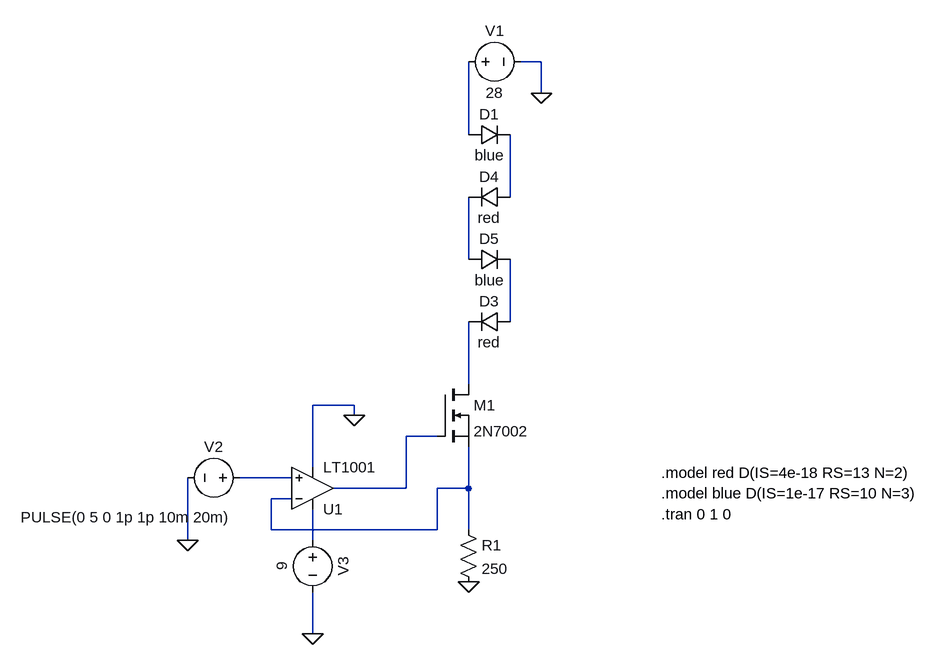
[diagram p0: schematic led_simulation.asc]
led_simulation.asc, the LTspice schematic file:
Version 4
SHEET 1 1220 916
WIRE 576 -288 544 -288
WIRE 576 -240 576 -288
WIRE 464 -176 464 -288
WIRE 528 -80 528 -176
WIRE 464 16 464 -80
WIRE 528 112 528 16
WIRE 464 208 464 112
WIRE 288 240 224 240
WIRE 288 256 288 240
WIRE 416 288 368 288
WIRE 224 336 224 240
WIRE 192 352 112 352
WIRE 368 368 368 288
WIRE 368 368 256 368
WIRE 464 368 464 304
WIRE 464 368 416 368
WIRE 192 384 160 384
WIRE 160 432 160 384
WIRE 416 432 416 368
WIRE 416 432 160 432
WIRE 464 432 464 368
WIRE 32 448 32 352
WIRE 224 448 224 400
WIRE 224 592 224 528
FLAG 32 448 0
FLAG 224 592 0
FLAG 464 512 0
FLAG 288 256 0
FLAG 576 -240 0
SYMBOL OpAmps\\LT1001 224 432 M180
SYMATTR InstName U1
SYMBOL voltage 128 352 R90
WINDOW 0 -32 56 VBottom 2
WINDOW 3 45 191 VTop 2
WINDOW 123 0 0 Left 0
WINDOW 39 0 0 Left 0
SYMATTR InstName V2
SYMATTR Value PULSE(0 5 0 1p 1p 10m 20m)
SYMBOL voltage 224 432 R0
WINDOW 0 32 56 VTop 2
WINDOW 3 -32 56 VBottom 2
WINDOW 123 0 0 Left 0
WINDOW 39 0 0 Left 0
SYMATTR InstName V3
SYMATTR Value 9
SYMBOL res 448 416 R0
SYMATTR InstName R1
SYMATTR Value 250
SYMBOL diode 528 96 R90
WINDOW 0 0 32 VBottom 2
WINDOW 3 32 32 VTop 2
SYMATTR InstName D3
SYMATTR Value red
SYMBOL voltage 448 -288 R270
WINDOW 0 32 56 VTop 2
WINDOW 3 -32 56 VBottom 2
WINDOW 123 0 0 Left 0
WINDOW 39 0 0 Left 0
SYMATTR InstName V1
SYMATTR Value 28
SYMBOL nmos 416 208 R0
SYMATTR InstName M1
SYMATTR Value 2N7002
SYMBOL diode 464 -160 R270
WINDOW 0 32 32 VTop 2
WINDOW 3 0 32 VBottom 2
SYMATTR InstName D1
SYMATTR Value blue
SYMBOL diode 528 -96 R90
WINDOW 0 0 32 VBottom 2
WINDOW 3 32 32 VTop 2
SYMATTR InstName D4
SYMATTR Value red
SYMBOL diode 464 32 R270
WINDOW 0 32 32 VTop 2
WINDOW 3 0 32 VBottom 2
SYMATTR InstName D5
SYMATTR Value blue
TEXT 760 408 Left 2 !.tran 0 1 0
TEXT 760 344 Left 2 !.model red D(IS=4e-18 RS=13 N=2)
TEXT 760 376 Left 2 !.model blue D(IS=1e-17 RS=10 N=3)

The netlist it stands for:
* led_simulation.asc
XU1 N007 N008 N009 0 N006 LT1001  ; pins In+ In- V+ V- OUT
V2 N007 0 PULSE(0 5 0 1p 1p 10m 20m)
V3 N009 0 9
R1 N008 0 250
D3 N004 N005 red
V1 N001 0 28
M1 N005 N006 N008 N008 2N7002
D1 N001 N002 blue
D4 N002 N003 red
D5 N003 N004 blue
.model D D
.lib standard.dio
.model NMOS NMOS
.model PMOS PMOS
.lib standard.mos
.tran 0 1 0
.model red D(IS=4e-18 RS=13 N=2)
.model blue D(IS=1e-17 RS=10 N=3)
.lib LTC.lib
.backanno
.end